# Altium schematic sheet CONN.SchDoc
size B
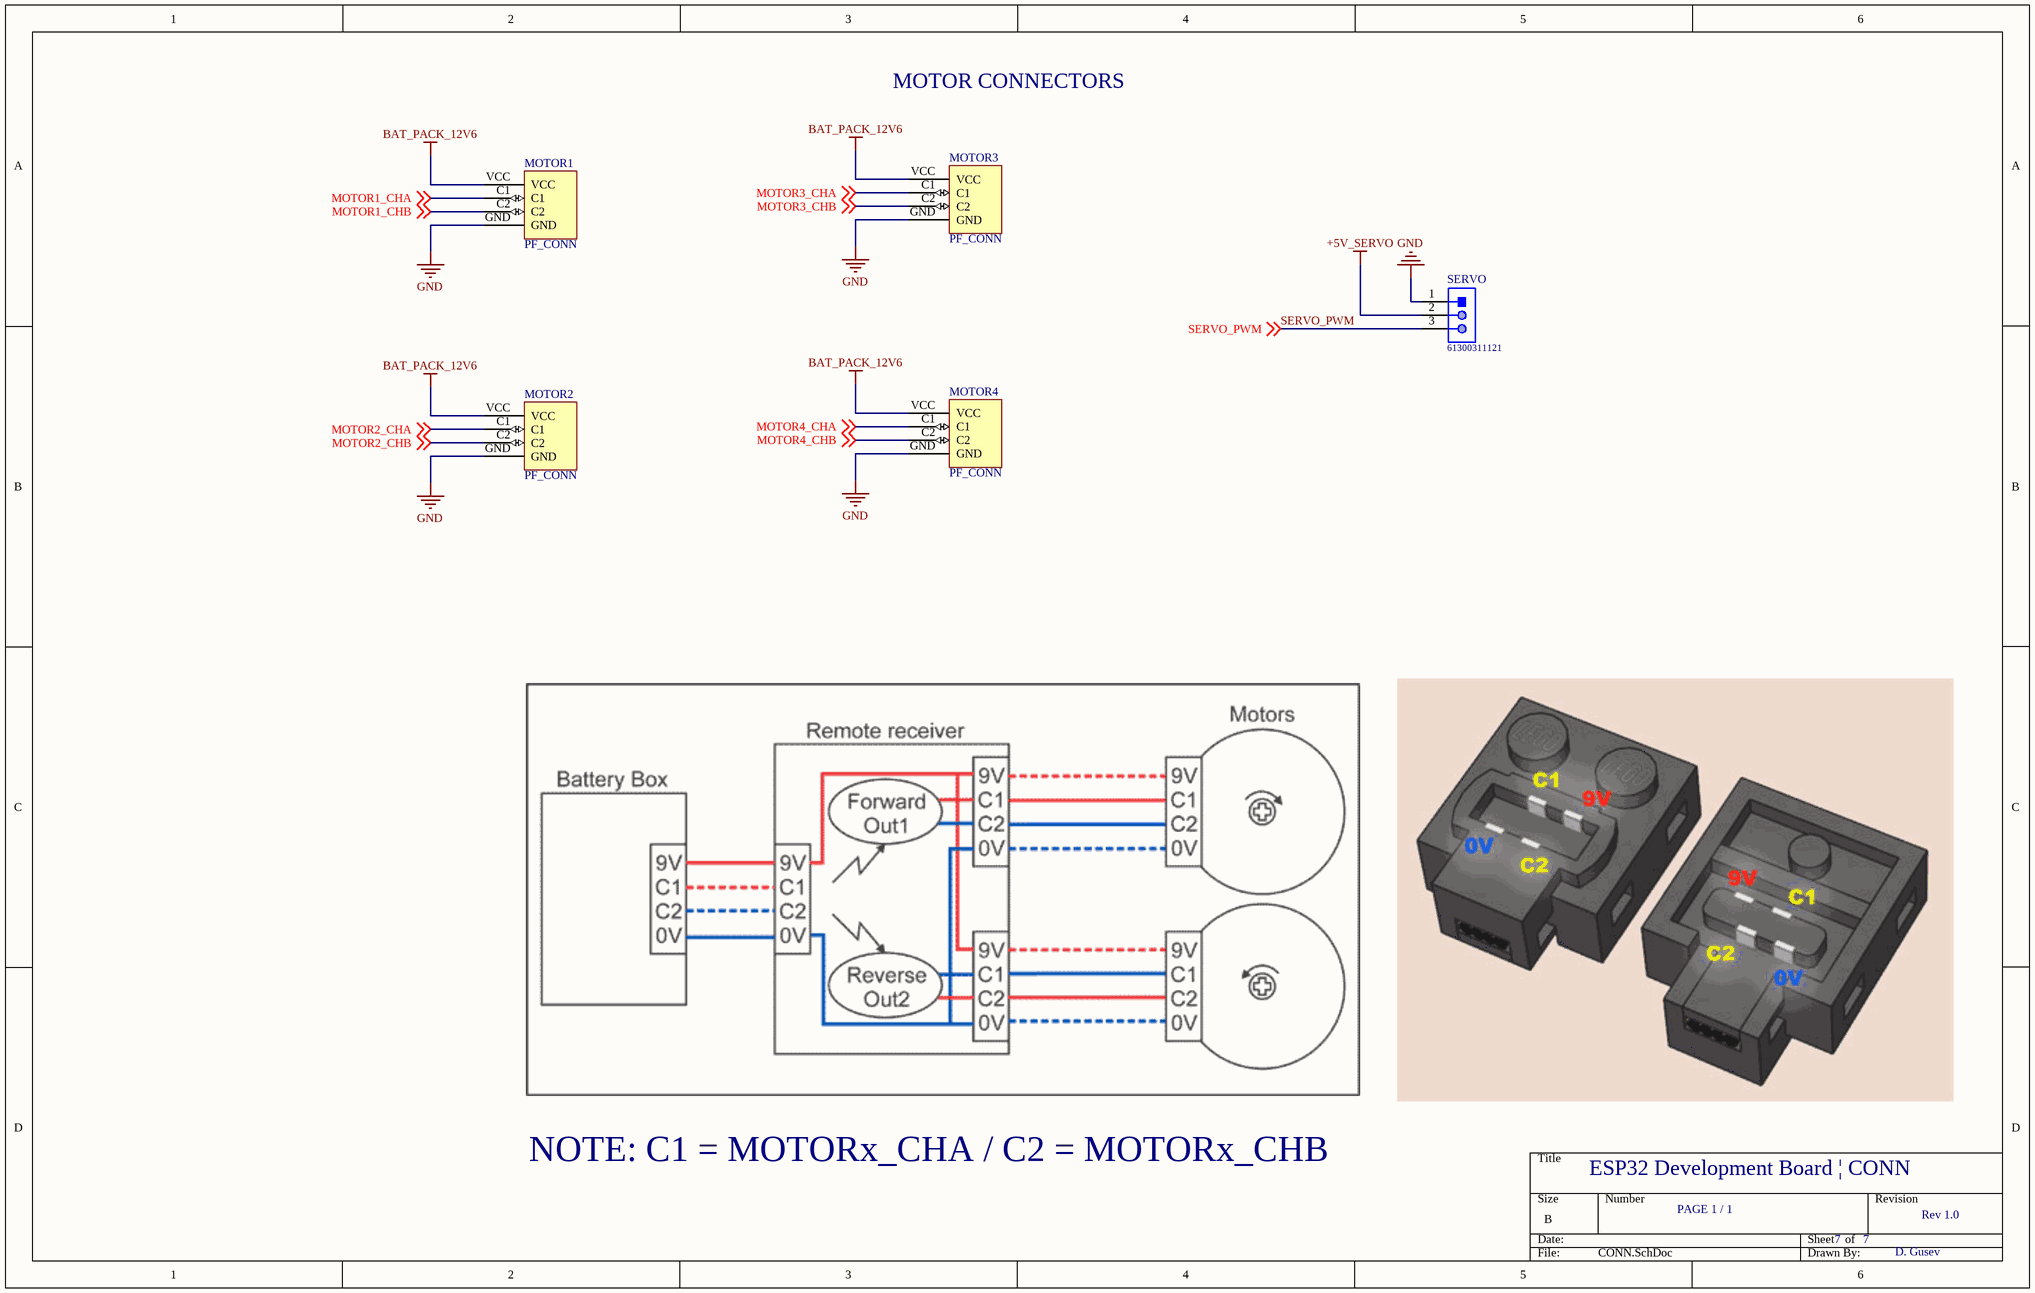
[diagram p0: CONN.SchDoc]

## Parts
MOTOR1  PF_CONN  [PF_CONN]
MOTOR2  PF_CONN  [PF_CONN]
MOTOR3  PF_CONN  [PF_CONN]
MOTOR4  PF_CONN  [PF_CONN]
SERVO  61300311121  [61300311121]

## Nets
+5V_SERVO: SERVO.2
BAT_PACK_12V6: MOTOR1.VCC MOTOR2.VCC MOTOR3.VCC MOTOR4.VCC
GND: MOTOR1.GND MOTOR2.GND MOTOR3.GND MOTOR4.GND SERVO.1
MOTOR1_CHA: MOTOR1.C1 ; off-sheet MOTOR1_CHA
MOTOR1_CHB: MOTOR1.C2 ; off-sheet MOTOR1_CHB
MOTOR2_CHA: MOTOR2.C1 ; off-sheet MOTOR2_CHA
MOTOR2_CHB: MOTOR2.C2 ; off-sheet MOTOR2_CHB
MOTOR3_CHA: MOTOR3.C1 ; off-sheet MOTOR3_CHA
MOTOR3_CHB: MOTOR3.C2 ; off-sheet MOTOR3_CHB
MOTOR4_CHA: MOTOR4.C1 ; off-sheet MOTOR4_CHA
MOTOR4_CHB: MOTOR4.C2 ; off-sheet MOTOR4_CHB
SERVO_PWM: SERVO.3 ; off-sheet SERVO_PWM

## Notes on the sheet
- MOTOR CONNECTORS
- NOTE: C1 = MOTORx_CHA / C2 = MOTORx_CHB
- ESP32 Development Board | CONN
- PAGE 1 / 1
- 7
- Rev 1.0
- D. Gusev

## Library data of the parts
SERVO = CMP-1502-01062-1: THT Vertical Pin Header WR-PHD, Pitch 2.54 mm, Single Row, 3 pins; Manufacturer: Wurth Elektronik; Withstanding Voltage: 500VAC; Working Voltage: 250VAC; Rated Current: 3A; Pitch: 2.54mm; Pin Number: 3; Gender: Male; Contact Resistance: 20mOhm; Package Reference: 61300311121; Manufacturer URL: http://www.we-online.de; Datasheet URL: https://katalog.we-online.de/em/datasheet/6130xx11121.pdf; Operating Temperature: -40to105degC; Part Number: 61300311121; Orientation: Vertical; Packaging: Bag; Row Number: Single; Mounting Technology: THT; Publisher: WurthElektronik